# Altium schematic sheet LED_HEADERS.SchDoc
size A
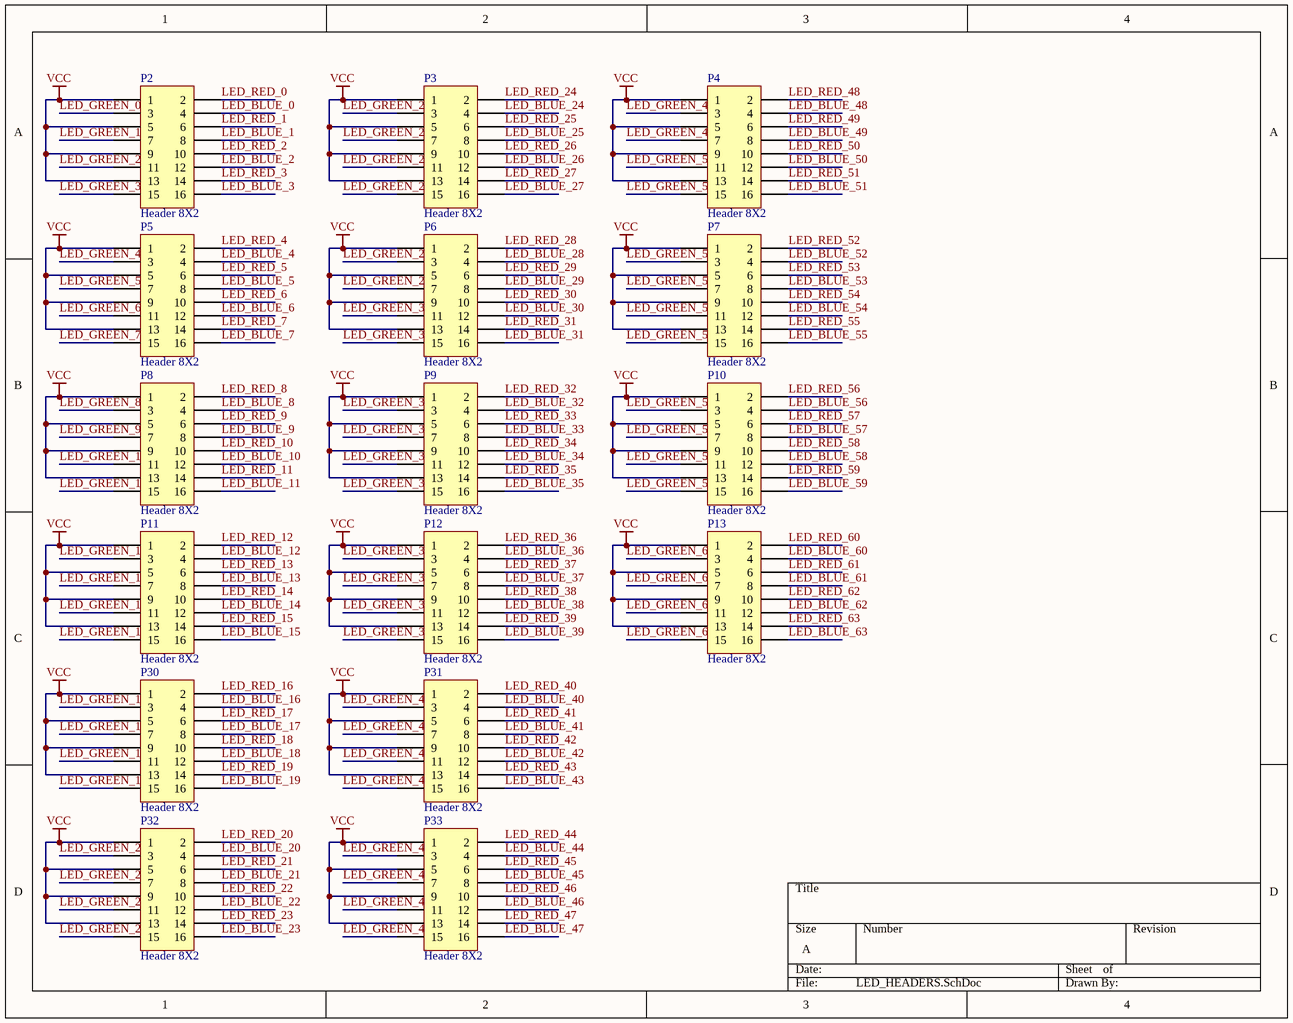
[diagram p0: LED_HEADERS.SchDoc]

## Parts
P2  Header 8X2  [HDR2X8]
P3  Header 8X2  [HDR2X8]
P4  Header 8X2  [HDR2X8]
P5  Header 8X2  [HDR2X8]
P6  Header 8X2  [HDR2X8]
P7  Header 8X2  [HDR2X8]
P8  Header 8X2  [HDR2X8]
P9  Header 8X2  [HDR2X8]
P10  Header 8X2  [HDR2X8]
P11  Header 8X2  [HDR2X8]
P12  Header 8X2  [HDR2X8]
P13  Header 8X2  [HDR2X8]
P30  Header 8X2  [HDR2X8]
P31  Header 8X2  [HDR2X8]
P32  Header 8X2  [HDR2X8]
P33  Header 8X2  [HDR2X8]

## Nets
VCC: P2.1 P2.5 P2.9 P2.13 P3.1 P3.5 P3.9 P3.13 P4.1 P4.5 P4.9 P4.13 P5.1 P5.5 P5.9 P5.13 P6.1 P6.5 P6.9 P6.13 P7.1 P7.5 P7.9 P7.13 P8.1 P8.5 P8.9 P8.13 P9.1 P9.5 P9.9 P9.13 P10.1 P10.5 P10.9 P10.13 P11.1 P11.5 P11.9 P11.13 P12.1 P12.5 P12.9 P12.13 P13.1 P13.5 P13.9 P13.13 P30.1 P30.5 P30.9 P30.13 P31.1 P31.5 P31.9 P31.13 P32.1 P32.5 P32.9 P32.13 P33.1 P33.5 P33.9 P33.13
LED_BLUE_0: P2.4
LED_BLUE_1: P2.8
LED_BLUE_2: P2.12
LED_BLUE_3: P2.16
LED_BLUE_4: P5.4
LED_BLUE_5: P5.8
LED_BLUE_6: P5.12
LED_BLUE_7: P5.16
LED_BLUE_8: P8.4
LED_BLUE_9: P8.8
LED_BLUE_10: P8.12
LED_BLUE_11: P8.16
LED_BLUE_12: P11.4
LED_BLUE_13: P11.8
LED_BLUE_14: P11.12
LED_BLUE_15: P11.16
LED_BLUE_16: P30.4
LED_BLUE_17: P30.8
LED_BLUE_18: P30.12
LED_BLUE_19: P30.16
LED_BLUE_20: P32.4
LED_BLUE_21: P32.8
LED_BLUE_22: P32.12
LED_BLUE_23: P32.16
LED_BLUE_24: P3.4
LED_BLUE_25: P3.8
LED_BLUE_26: P3.12
LED_BLUE_27: P3.16
LED_BLUE_28: P6.4
LED_BLUE_29: P6.8
LED_BLUE_30: P6.12
LED_BLUE_31: P6.16
LED_BLUE_32: P9.4
LED_BLUE_33: P9.8
LED_BLUE_34: P9.12
LED_BLUE_35: P9.16
LED_BLUE_36: P12.4
LED_BLUE_37: P12.8
LED_BLUE_38: P12.12
LED_BLUE_39: P12.16
LED_BLUE_40: P31.4
LED_BLUE_41: P31.8
LED_BLUE_42: P31.12
LED_BLUE_43: P31.16
LED_BLUE_44: P33.4
LED_BLUE_45: P33.8
LED_BLUE_46: P33.12
LED_BLUE_47: P33.16
LED_BLUE_48: P4.4
LED_BLUE_49: P4.8
LED_BLUE_50: P4.12
LED_BLUE_51: P4.16
LED_BLUE_52: P7.4
LED_BLUE_53: P7.8
LED_BLUE_54: P7.12
LED_BLUE_55: P7.16
LED_BLUE_56: P10.4
LED_BLUE_57: P10.8
LED_BLUE_58: P10.12
LED_BLUE_59: P10.16
LED_BLUE_60: P13.4
LED_BLUE_61: P13.8
LED_BLUE_62: P13.12
LED_BLUE_63: P13.16
LED_GREEN_0: P2.3
LED_GREEN_1: P2.7
LED_GREEN_2: P2.11
LED_GREEN_3: P2.15
LED_GREEN_4: P5.3
LED_GREEN_5: P5.7
LED_GREEN_6: P5.11
LED_GREEN_7: P5.15
LED_GREEN_8: P8.3
LED_GREEN_9: P8.7
LED_GREEN_10: P8.11
LED_GREEN_11: P8.15
LED_GREEN_12: P11.3
LED_GREEN_13: P11.7
LED_GREEN_14: P11.11
LED_GREEN_15: P11.15
LED_GREEN_16: P30.3
LED_GREEN_17: P30.7
LED_GREEN_18: P30.11
LED_GREEN_19: P30.15
LED_GREEN_20: P32.3
LED_GREEN_21: P32.7
LED_GREEN_22: P32.11
LED_GREEN_23: P32.15
LED_GREEN_24: P3.3
LED_GREEN_25: P3.7
LED_GREEN_26: P3.11
LED_GREEN_27: P3.15
LED_GREEN_28: P6.3
LED_GREEN_29: P6.7
LED_GREEN_30: P6.11
LED_GREEN_31: P6.15
LED_GREEN_32: P9.3
LED_GREEN_33: P9.7
LED_GREEN_34: P9.11
LED_GREEN_35: P9.15
LED_GREEN_36: P12.3
LED_GREEN_37: P12.7
LED_GREEN_38: P12.11
LED_GREEN_39: P12.15
LED_GREEN_40: P31.3
LED_GREEN_41: P31.7
LED_GREEN_42: P31.11
LED_GREEN_43: P31.15
LED_GREEN_44: P33.3
LED_GREEN_45: P33.7
LED_GREEN_46: P33.11
LED_GREEN_47: P33.15
LED_GREEN_48: P4.3
LED_GREEN_49: P4.7
LED_GREEN_50: P4.11
LED_GREEN_51: P4.15
LED_GREEN_52: P7.3
LED_GREEN_53: P7.7
LED_GREEN_54: P7.11
LED_GREEN_55: P7.15
LED_GREEN_56: P10.3
LED_GREEN_57: P10.7
LED_GREEN_58: P10.11
LED_GREEN_59: P10.15
LED_GREEN_60: P13.3
LED_GREEN_61: P13.7
LED_GREEN_62: P13.11
LED_GREEN_63: P13.15
LED_RED_0: P2.2
LED_RED_1: P2.6
LED_RED_2: P2.10
LED_RED_3: P2.14
LED_RED_4: P5.2
LED_RED_5: P5.6
LED_RED_6: P5.10
LED_RED_7: P5.14
LED_RED_8: P8.2
LED_RED_9: P8.6
LED_RED_10: P8.10
LED_RED_11: P8.14
LED_RED_12: P11.2
LED_RED_13: P11.6
LED_RED_14: P11.10
LED_RED_15: P11.14
LED_RED_16: P30.2
LED_RED_17: P30.6
LED_RED_18: P30.10
LED_RED_19: P30.14
LED_RED_20: P32.2
LED_RED_21: P32.6
LED_RED_22: P32.10
LED_RED_23: P32.14
LED_RED_24: P3.2
LED_RED_25: P3.6
LED_RED_26: P3.10
LED_RED_27: P3.14
LED_RED_28: P6.2
LED_RED_29: P6.6
LED_RED_30: P6.10
LED_RED_31: P6.14
LED_RED_32: P9.2
LED_RED_33: P9.6
LED_RED_34: P9.10
LED_RED_35: P9.14
LED_RED_36: P12.2
LED_RED_37: P12.6
LED_RED_38: P12.10
LED_RED_39: P12.14
LED_RED_40: P31.2
LED_RED_41: P31.6
LED_RED_42: P31.10
LED_RED_43: P31.14
LED_RED_44: P33.2
LED_RED_45: P33.6
LED_RED_46: P33.10
LED_RED_47: P33.14
LED_RED_48: P4.2
LED_RED_49: P4.6
LED_RED_50: P4.10
LED_RED_51: P4.14
LED_RED_52: P7.2
LED_RED_53: P7.6
LED_RED_54: P7.10
LED_RED_55: P7.14
LED_RED_56: P10.2
LED_RED_57: P10.6
LED_RED_58: P10.10
LED_RED_59: P10.14
LED_RED_60: P13.2
LED_RED_61: P13.6
LED_RED_62: P13.10
LED_RED_63: P13.14

## Library data of the parts
P2-P13 P30-P33 = Header 8X2: Header, 8-Pin, Dual row; LatestRevisionDate: 17-Jul-2002; LatestRevisionNote: Re-released for DXP Platform.; Publisher: Altium Limited